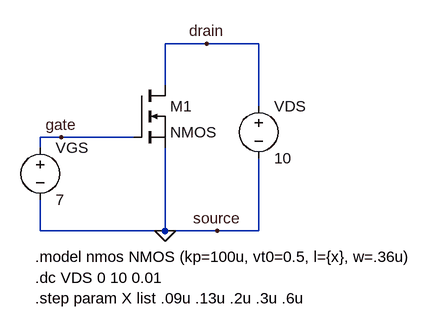
[diagram p0: schematic part3_a_vgs_sweep.asc]
part3_a_vgs_sweep.asc, the LTspice schematic file:
Version 4
SHEET 1 880 680
WIRE 160 48 96 48
WIRE 240 48 160 48
WIRE 96 112 96 48
WIRE 240 144 240 48
WIRE -64 192 -96 192
WIRE 48 192 -64 192
WIRE -96 208 -96 192
WIRE -96 336 -96 288
WIRE 96 336 96 208
WIRE 96 336 -96 336
WIRE 176 336 96 336
WIRE 240 336 240 224
WIRE 240 336 176 336
FLAG 96 336 0
FLAG -64 192 gate
FLAG 160 48 drain
FLAG 176 336 source
SYMBOL voltage -96 192 R0
SYMATTR InstName VGS
SYMATTR Value 7
SYMBOL voltage 240 128 R0
SYMATTR InstName VDS
SYMATTR Value 10
SYMBOL nmos 48 112 R0
SYMATTR InstName M1
TEXT -104 376 Left 2 !.model nmos NMOS (kp=100u, vt0=0.5, l={x}, w=.36u)
TEXT -104 408 Left 2 !.dc VDS 0 10 0.01
TEXT -104 440 Left 2 !.step param X list .09u .13u .2u .3u .6u

The netlist it stands for:
* part3_a_vgs_sweep.asc
VGS gate 0 7
VDS drain 0 10
M1 drain gate 0 0 NMOS
.model NMOS NMOS
.model PMOS PMOS
.lib standard.mos
.model nmos NMOS (kp=100u, vt0=0.5, l={x}, w=.36u)
.dc VDS 0 10 0.01
.step param X list .09u .13u .2u .3u .6u
.backanno
.end